# EAGLE design V1 (EAGLE 9.6.2)
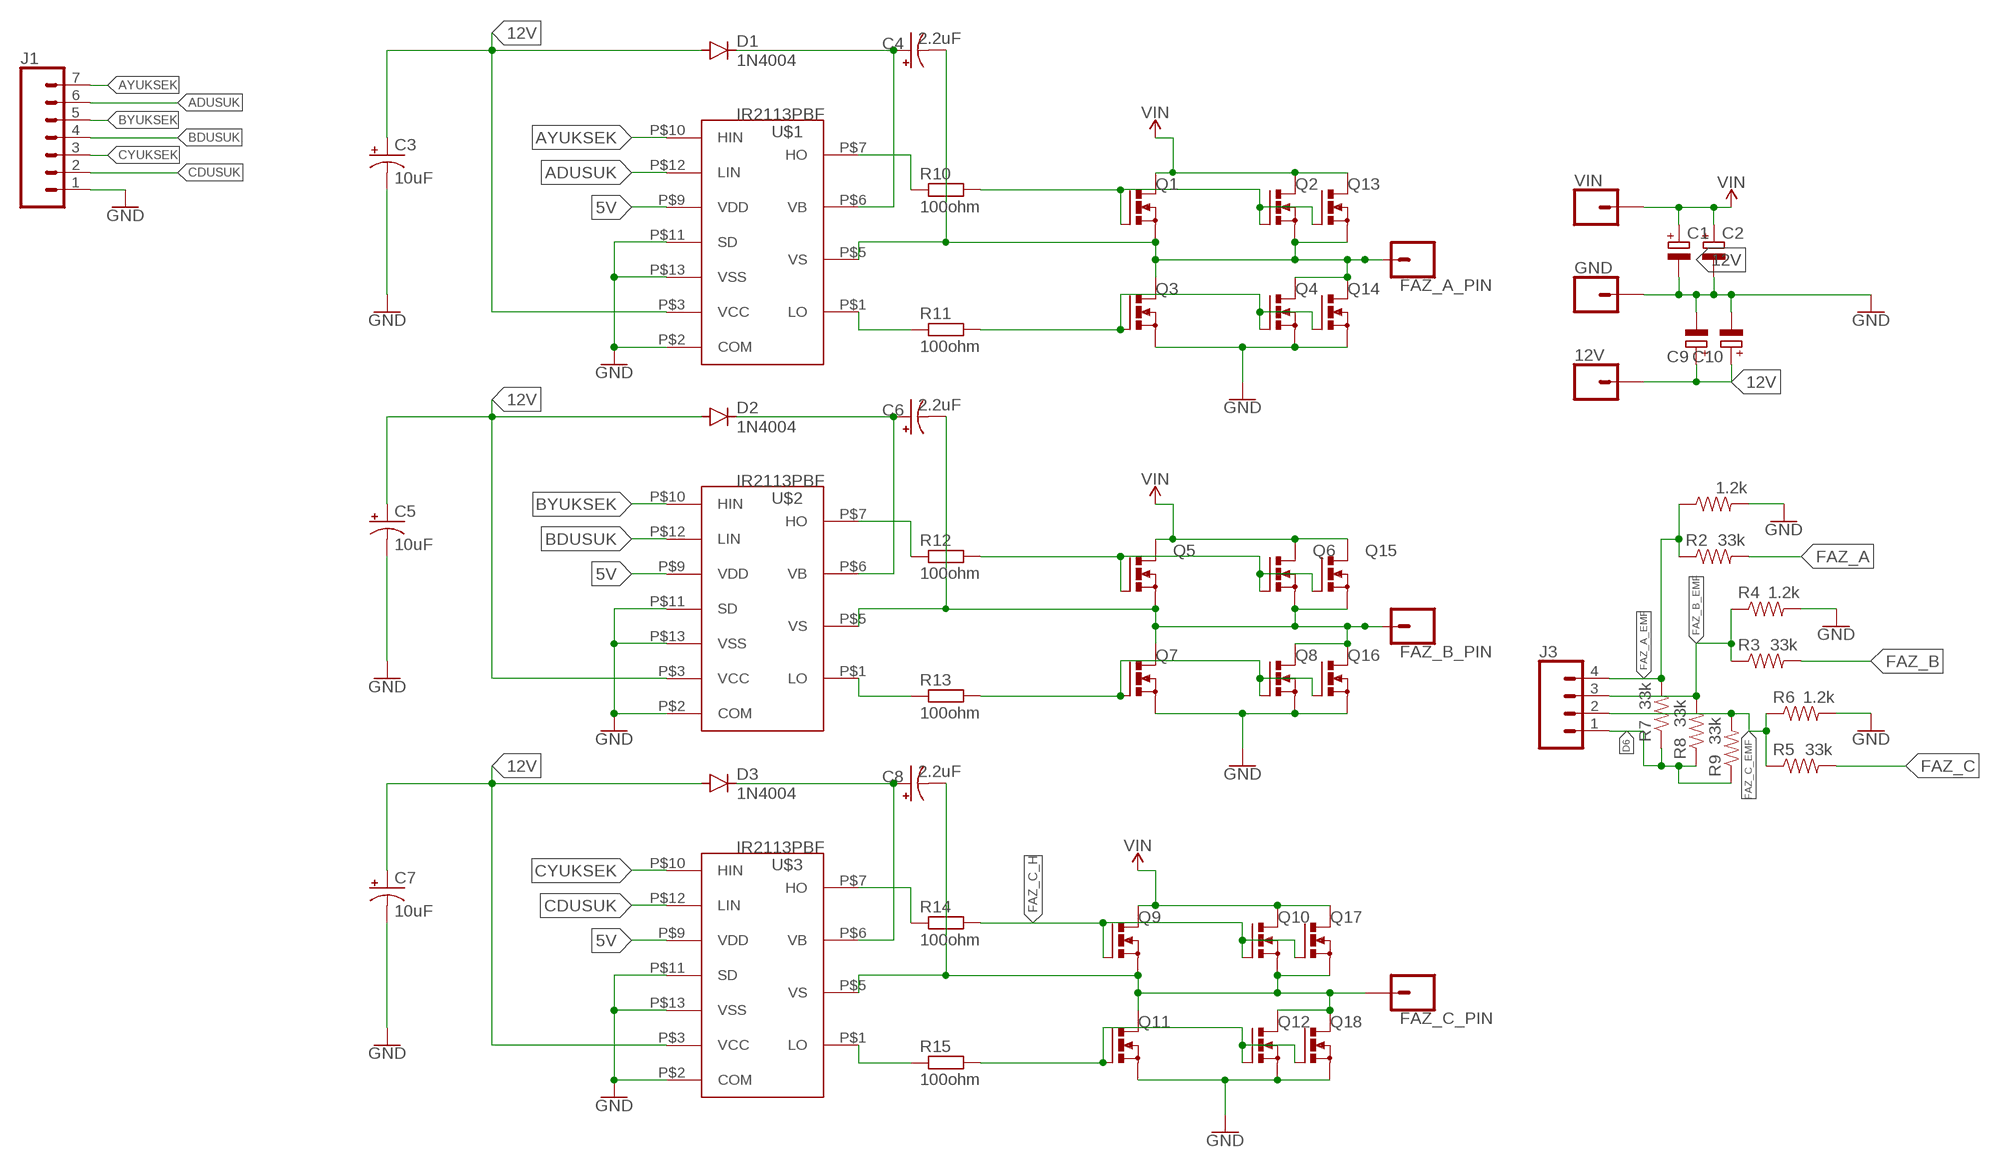
[diagram p0: schematic, sheet 1]

## Parts
12V  CONN_01SNAP-MALE  [SNAP-MALE]
C1  C-POL_RADIAL-25MM-DIA  [CAPPRD550W110D1250H2500B]
C2  C-POL_RADIAL-25MM-DIA  [CAPPRD550W110D1250H2500B]
C3  10uF  10UF-POLAR-RADIAL-2.5MM-25V-20%  [CPOL-RADIAL-2.5MM-5MM]
C4  2.2uF  10UF-POLAR-RADIAL-2.5MM-25V-20%  [CPOL-RADIAL-2.5MM-5MM]
C5  10uF  10UF-POLAR-RADIAL-2.5MM-25V-20%  [CPOL-RADIAL-2.5MM-5MM]
C6  2.2uF  10UF-POLAR-RADIAL-2.5MM-25V-20%  [CPOL-RADIAL-2.5MM-5MM]
C7  10uF  10UF-POLAR-RADIAL-2.5MM-25V-20%  [CPOL-RADIAL-2.5MM-5MM]
C8  2.2uF  10UF-POLAR-RADIAL-2.5MM-25V-20%  [CPOL-RADIAL-2.5MM-5MM]
C9  C-POL_RADIAL-25MM-DIA  [CAPPRD550W110D1250H2500B]
C10  C-POL_RADIAL-25MM-DIA  [CAPPRD550W110D1250H2500B]
D1  1N4004  [DO41-10]
D2  1N4004  [DO41-10]
D3  1N4004  [DO41-10]
FAZ_A_PIN  CONN_01SNAP-MALE  [SNAP-MALE]
FAZ_B_PIN  CONN_01SNAP-MALE  [SNAP-MALE]
FAZ_C_PIN  CONN_01SNAP-MALE  [SNAP-MALE]
GND  CONN_01SNAP-MALE  [SNAP-MALE]
J1  CONN_07  [1X07]
J3  CONN_04  [1X04]
Q1  PMOSFET_NTO220BV  [TO220BV]
Q2  PMOSFET_NTO220BV  [TO220BV]
Q3  PMOSFET_NTO220BV  [TO220BV]
Q4  PMOSFET_NTO220BV  [TO220BV]
Q5  PMOSFET_NTO220BV  [TO220BV]
Q6  PMOSFET_NTO220BV  [TO220BV]
Q7  PMOSFET_NTO220BV  [TO220BV]
Q8  PMOSFET_NTO220BV  [TO220BV]
Q9  PMOSFET_NTO220BV  [TO220BV]
Q10  PMOSFET_NTO220BV  [TO220BV]
Q11  PMOSFET_NTO220BV  [TO220BV]
Q12  PMOSFET_NTO220BV  [TO220BV]
Q13  PMOSFET_NTO220BV  [TO220BV]
Q14  PMOSFET_NTO220BV  [TO220BV]
Q15  PMOSFET_NTO220BV  [TO220BV]
Q16  PMOSFET_NTO220BV  [TO220BV]
Q17  PMOSFET_NTO220BV  [TO220BV]
Q18  PMOSFET_NTO220BV  [TO220BV]
R1  1.2k  15KOHM-HORIZ-1/4W-5%  [AXIAL-0.3]
R2  33k  15KOHM-HORIZ-1/4W-5%  [AXIAL-0.3]
R3  33k  15KOHM-HORIZ-1/4W-5%  [AXIAL-0.3]
R4  1.2k  15KOHM-HORIZ-1/4W-5%  [AXIAL-0.3]
R5  33k  15KOHM-HORIZ-1/4W-5%  [AXIAL-0.3]
R6  1.2k  15KOHM-HORIZ-1/4W-5%  [AXIAL-0.3]
R7  33k  15KOHM-HORIZ-1/4W-5%  [AXIAL-0.3]
R8  33k  15KOHM-HORIZ-1/4W-5%  [AXIAL-0.3]
R9  33k  15KOHM-HORIZ-1/4W-5%  [AXIAL-0.3]
R10  100ohm  R-EU_0207/10  [0207/10]
R11  100ohm  R-EU_0207/10  [0207/10]
R12  100ohm  R-EU_0207/10  [0207/10]
R13  100ohm  R-EU_0207/10  [0207/10]
R14  100ohm  R-EU_0207/10  [0207/10]
R15  100ohm  R-EU_0207/10  [0207/10]
U$1  IR2113PBF  [PDIP-14]
U$2  IR2113PBF  [PDIP-14]
U$3  IR2113PBF  [PDIP-14]
VIN  CONN_01SNAP-MALE  [SNAP-MALE]

## Nets
5V: U$1.P$9(VDD) U$2.P$9(VDD) U$3.P$9(VDD)
12V: 12V.2 C3.1(+) C5.1(+) C7.1(+) C9.1(+) C10.1(+) D1.A D2.A D3.A U$1.P$3(VCC) U$2.P$3(VCC) U$3.P$3(VCC)
ADUSUK: J1.6 U$1.P$12(LIN)
AYUKSEK: J1.7 U$1.P$10(HIN)
BDUSUK: J1.4 U$2.P$12(LIN)
BYUKSEK: J1.5 U$2.P$10(HIN)
CDUSUK: J1.2 U$3.P$12(LIN)
CYUKSEK: J1.3 U$3.P$10(HIN)
D6: J3.1 R7.P$1 R8.P$1 R9.P$1
FAZ_A: C4.2(-) FAZ_A_PIN.2 Q1.S Q2.S Q3.D Q4.D Q13.S Q14.D R2.P$2 U$1.P$5(VS)
FAZ_A_EMF: J3.4 R1.P$1 R2.P$1 R7.P$2
FAZ_A_H: Q1.G Q2.G Q13.G R10.2
FAZ_A_L: Q3.G Q4.G Q14.G R11.2
FAZ_B: C6.2(-) FAZ_B_PIN.2 Q5.S Q6.S Q7.D Q8.D Q15.S Q16.D R3.P$2 U$2.P$5(VS)
FAZ_B_EMF: J3.3 R3.P$1 R4.P$1 R8.P$2
FAZ_B_H: Q5.G Q6.G Q15.G R12.2
FAZ_B_L: Q7.G Q8.G Q16.G R13.2
FAZ_C: C8.2(-) FAZ_C_PIN.2 Q9.S Q10.S Q11.D Q12.D Q17.S Q18.D R5.P$2 U$3.P$5(VS)
FAZ_C_EMF: J3.2 R5.P$1 R6.P$1 R9.P$2
FAZ_C_H: Q9.G Q10.G Q17.G R14.2
FAZ_C_L: Q11.G Q12.G Q18.G R15.2
GND: C1.2(-) C2.2(-) C3.2(-) C5.2(-) C7.2(-) C9.2(-) C10.2(-) GND.2 J1.1 Q3.S Q4.S Q7.S Q8.S Q11.S Q12.S Q14.S Q16.S Q18.S R1.P$2 R4.P$2 R6.P$2 U$1.P$2(COM) U$1.P$11(SD) U$1.P$13(VSS) U$2.P$2(COM) U$2.P$11(SD) U$2.P$13(VSS) U$3.P$2(COM) U$3.P$11(SD) U$3.P$13(VSS)
N$1: C6.1(+) D2.C U$2.P$6(VB)
N$2: R13.1 U$2.P$1(LO)
N$3: R12.1 U$2.P$7(HO)
N$4: C4.1(+) D1.C U$1.P$6(VB)
N$5: C8.1(+) D3.C U$3.P$6(VB)
N$6: R10.1 U$1.P$7(HO)
N$7: R15.1 U$3.P$1(LO)
N$8: R11.1 U$1.P$1(LO)
N$9: R14.1 U$3.P$7(HO)
VIN: C1.1(+) C2.1(+) Q1.D Q2.D Q5.D Q6.D Q9.D Q10.D Q13.D Q15.D Q17.D VIN.2

## Library data of the parts
12V FAZ_A_PIN FAZ_B_PIN FAZ_C_PIN GND VIN = SparkFun-Connectors:CONN_01: Single connection point. Often used as Generic Header-pin footprint for 0.1 inch spaced/style header connections On any of the 0.1 inch spaced packages, you can populate with these: Break Away Headers - Straight <https://www.sparkfun.com/products/116> (PRT-00116) Break Away Male Headers - Right Angle <https://www.sparkfun.com/products/553> (PRT-00553) Female Headers <https://www.sparkfun.com/products/115> (PRT-00115) Break Away Headers - Machine Pin <https://www.sparkfun.com/products/117> (PRT-00117) Break Away Female Headers - Swiss Machine Pin <https://www.sparkfun.com/products/743> (PRT-00743) This device is also useful as a general connection point to wire up your design to another part of your project. Our various solder wires solder well into these plated through hole pads. Hook-Up Wire - Assortment (Stranded, 22 AWG) <https://www.sparkfun.com/products/11375> (PRT-11375) Hook-Up Wire - Assortment (Solid Core, 22 AWG) <https://www.sparkfun.com/products/11367> (PRT-11367) View the entire wire category on our website here <https://www.sparkfun.com/categories/141> Special notes: SMTSO-256-ET is a "flush mount" nut for a 4-40 screw. We mostly use this on specialty testbeds; it is a nice way to connect hardware to your PCB at an adjustable hieght. Also note, the SNAP packages are for using a snappable style connector. We sell a baggie of snaps and they are also used on two LilyPad designs: Snap Assortment - 30 pack (male and female) <https://www.sparkfun.com/products/11347> (DEV-11347) LilyPad Arduino SimpleSnap <https://www.sparkfun.com/products/10941> (DEV-10941) LilyPad SimpleSnap Protoboard <https://www.sparkfun.com/products/10940> (DEV-10940)
C1 C2 C9 C10 = Capacitor:C-POL: Capacitor Polarised - Generic; CATEGORY: Capacitor
C3 C5 C7 = SparkFun-Capacitors:10UF-POLAR: 10.0µF polarized capacitors A capacitor is a passive two-terminal electrical component used to store electrical energy temporarily in an electric field.; PROD_ID: CAP-08440
C4 C6 C8 = SparkFun-Capacitors:10UF-POLAR: 10.0µF polarized capacitors A capacitor is a passive two-terminal electrical component used to store electrical energy temporarily in an electric field.; PROD_ID: CAP-08440; VALUE: 10uF
D1-D3 = diode:1N4004: DIODE general purpose rectifier, 1 A
J1 = SparkFun-Connectors:CONN_07: Multi connection point. Often used as Generic Header-pin footprint for 0.1 inch spaced/style header connections On any of the 0.1 inch spaced packages, you can populate with these: Break Away Headers - Straight <https://www.sparkfun.com/products/116> (PRT-00116) Break Away Male Headers - Right Angle <https://www.sparkfun.com/products/553> (PRT-00553) Female Headers <https://www.sparkfun.com/products/115> (PRT-00115) Break Away Headers - Machine Pin <https://www.sparkfun.com/products/117> (PRT-00117) Break Away Female Headers - Swiss Machine Pin <https://www.sparkfun.com/products/743> (PRT-00743) For SCREWTERMINALS and SPRING TERMINALS visit here: Screw Terimnals on SparkFun.com <https://www.sparkfun.com/search/results?term=Screw+Terminals> (5mm/3.5mm/2.54mm spacing) This device is also useful as a general connection point to wire up your design to another part of your project. Our various solder wires solder well into these plated through hole pads. Hook-Up Wire - Assortment (Stranded, 22 AWG) <https://www.sparkfun.com/products/11375> (PRT-11375) Hook-Up Wire - Assortment (Solid Core, 22 AWG) <https://www.sparkfun.com/products/11367> (PRT-11367) View the entire wire category on our website here <https://www.sparkfun.com/categories/141> Special notes: Molex polarized connector foot print use with SKU : PRT-08231 with associated crimp pins and housings. 1MM SMD Version SKU: PRT-10208 NOTES ON THE VARIANTS LOCK and LOCK_LONGPADS... This footprint was designed to help hold the alignment of a through-hole component (i.e. 6-pin header) while soldering it into place. You may notice that each hole has been shifted either up or down by 0.005 of an inch from it's more standard position (which is a perfectly straight line). This slight alteration caused the pins (the squares in the middle) to touch the edges of the holes. Because they are alternating, it causes a "brace" to hold the component in place. 0.005 has proven to be the perfect amount of "off-center" position when using our standard breakaway headers. Although looks a little odd when you look at the bare footprint, once you have a header in there, the alteration is very hard to notice. Also,if you push a header all the way into place, it is covered up entirely on the bottom side.
J3 = SparkFun-Connectors:CONN_04: Multi connection point. Often used as Generic Header-pin footprint for 0.1 inch spaced/style header connections On any of the 0.1 inch spaced packages, you can populate with these: Break Away Headers - Straight <https://www.sparkfun.com/products/116> (PRT-00116) Break Away Male Headers - Right Angle <https://www.sparkfun.com/products/553> (PRT-00553) Female Headers <https://www.sparkfun.com/products/115> (PRT-00115) Break Away Headers - Machine Pin <https://www.sparkfun.com/products/117> (PRT-00117) Break Away Female Headers - Swiss Machine Pin <https://www.sparkfun.com/products/743> (PRT-00743) For SCREWTERMINALS and SPRING TERMINALS visit here: Screw Terimnals on SparkFun.com <https://www.sparkfun.com/search/results?term=Screw+Terminals> (5mm/3.5mm/2.54mm spacing) This device is also useful as a general connection point to wire up your design to another part of your project. Our various solder wires solder well into these plated through hole pads. Hook-Up Wire - Assortment (Stranded, 22 AWG) <https://www.sparkfun.com/products/11375> (PRT-11375) Hook-Up Wire - Assortment (Solid Core, 22 AWG) <https://www.sparkfun.com/products/11367> (PRT-11367) View the entire wire category on our website here <https://www.sparkfun.com/categories/141> Special notes: Molex polarized connector foot print use with SKU : PRT-08231 with associated crimp pins and housings. 1MM SMD Version SKU: PRT-10208; PROD_ID: CONN-09696
Q1-Q18 = transistor-power:PMOSFET_N: Power MOSFET N-Channel
R1-R9 = SparkFun-Resistors:15KOHM: 15kΩ resistor A resistor is a passive two-terminal electrical component that implements electrical resistance as a circuit element. Resistors act to reduce current flow, and, at the same time, act to lower voltage levels within circuits. - Wikipedia; PROD_ID: RES-11360; VALUE: 15k
R10-R15 = resistor:R-EU_: RESISTOR, European symbol
U$1-U$3 = El_yapimi:IR2113PBF

## Board
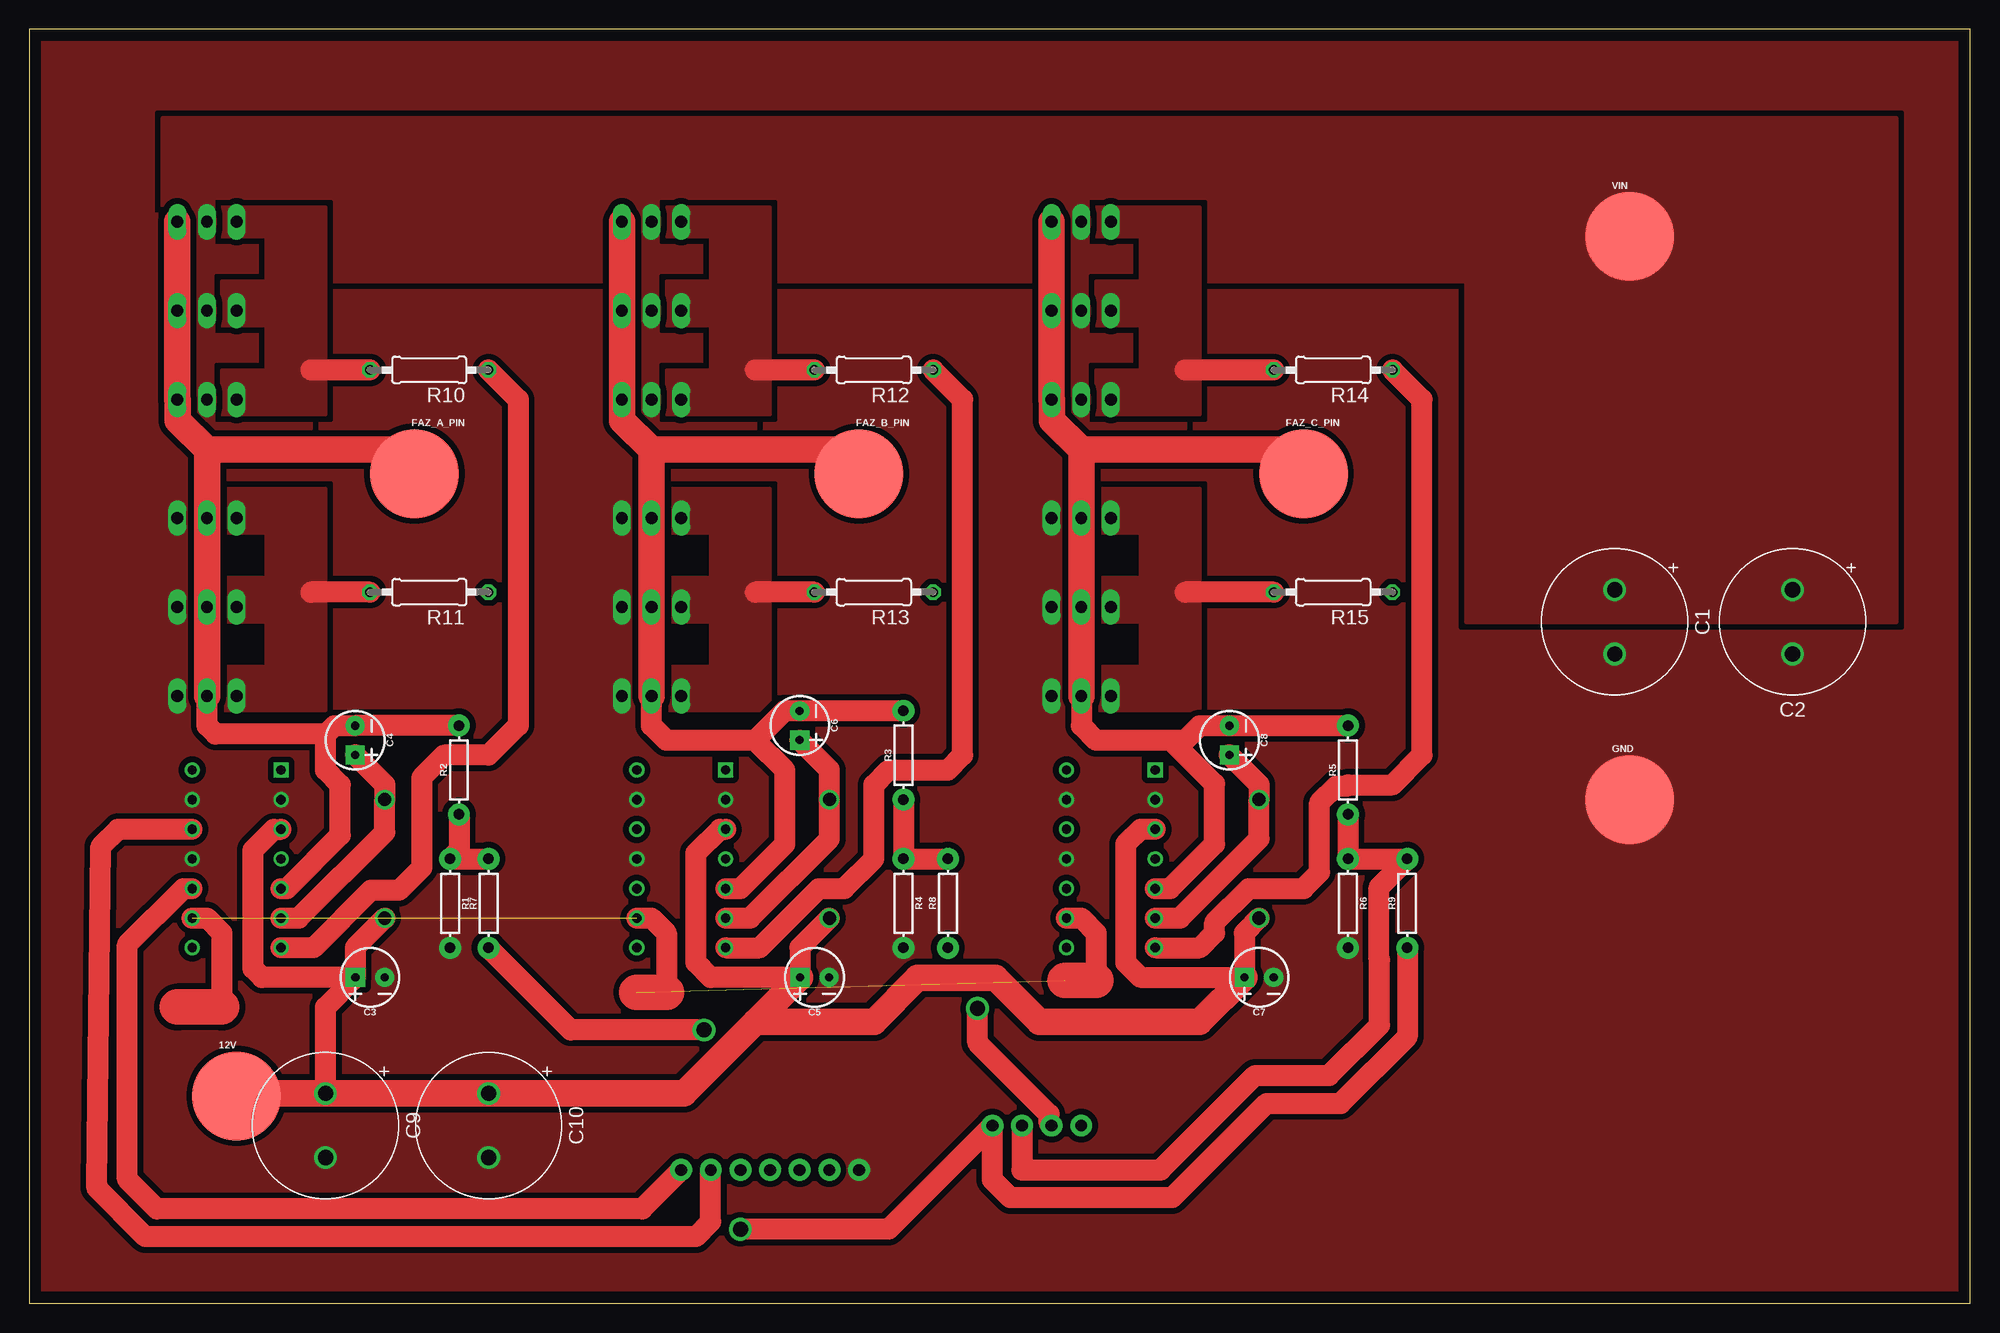
[diagram p1: board, top side]
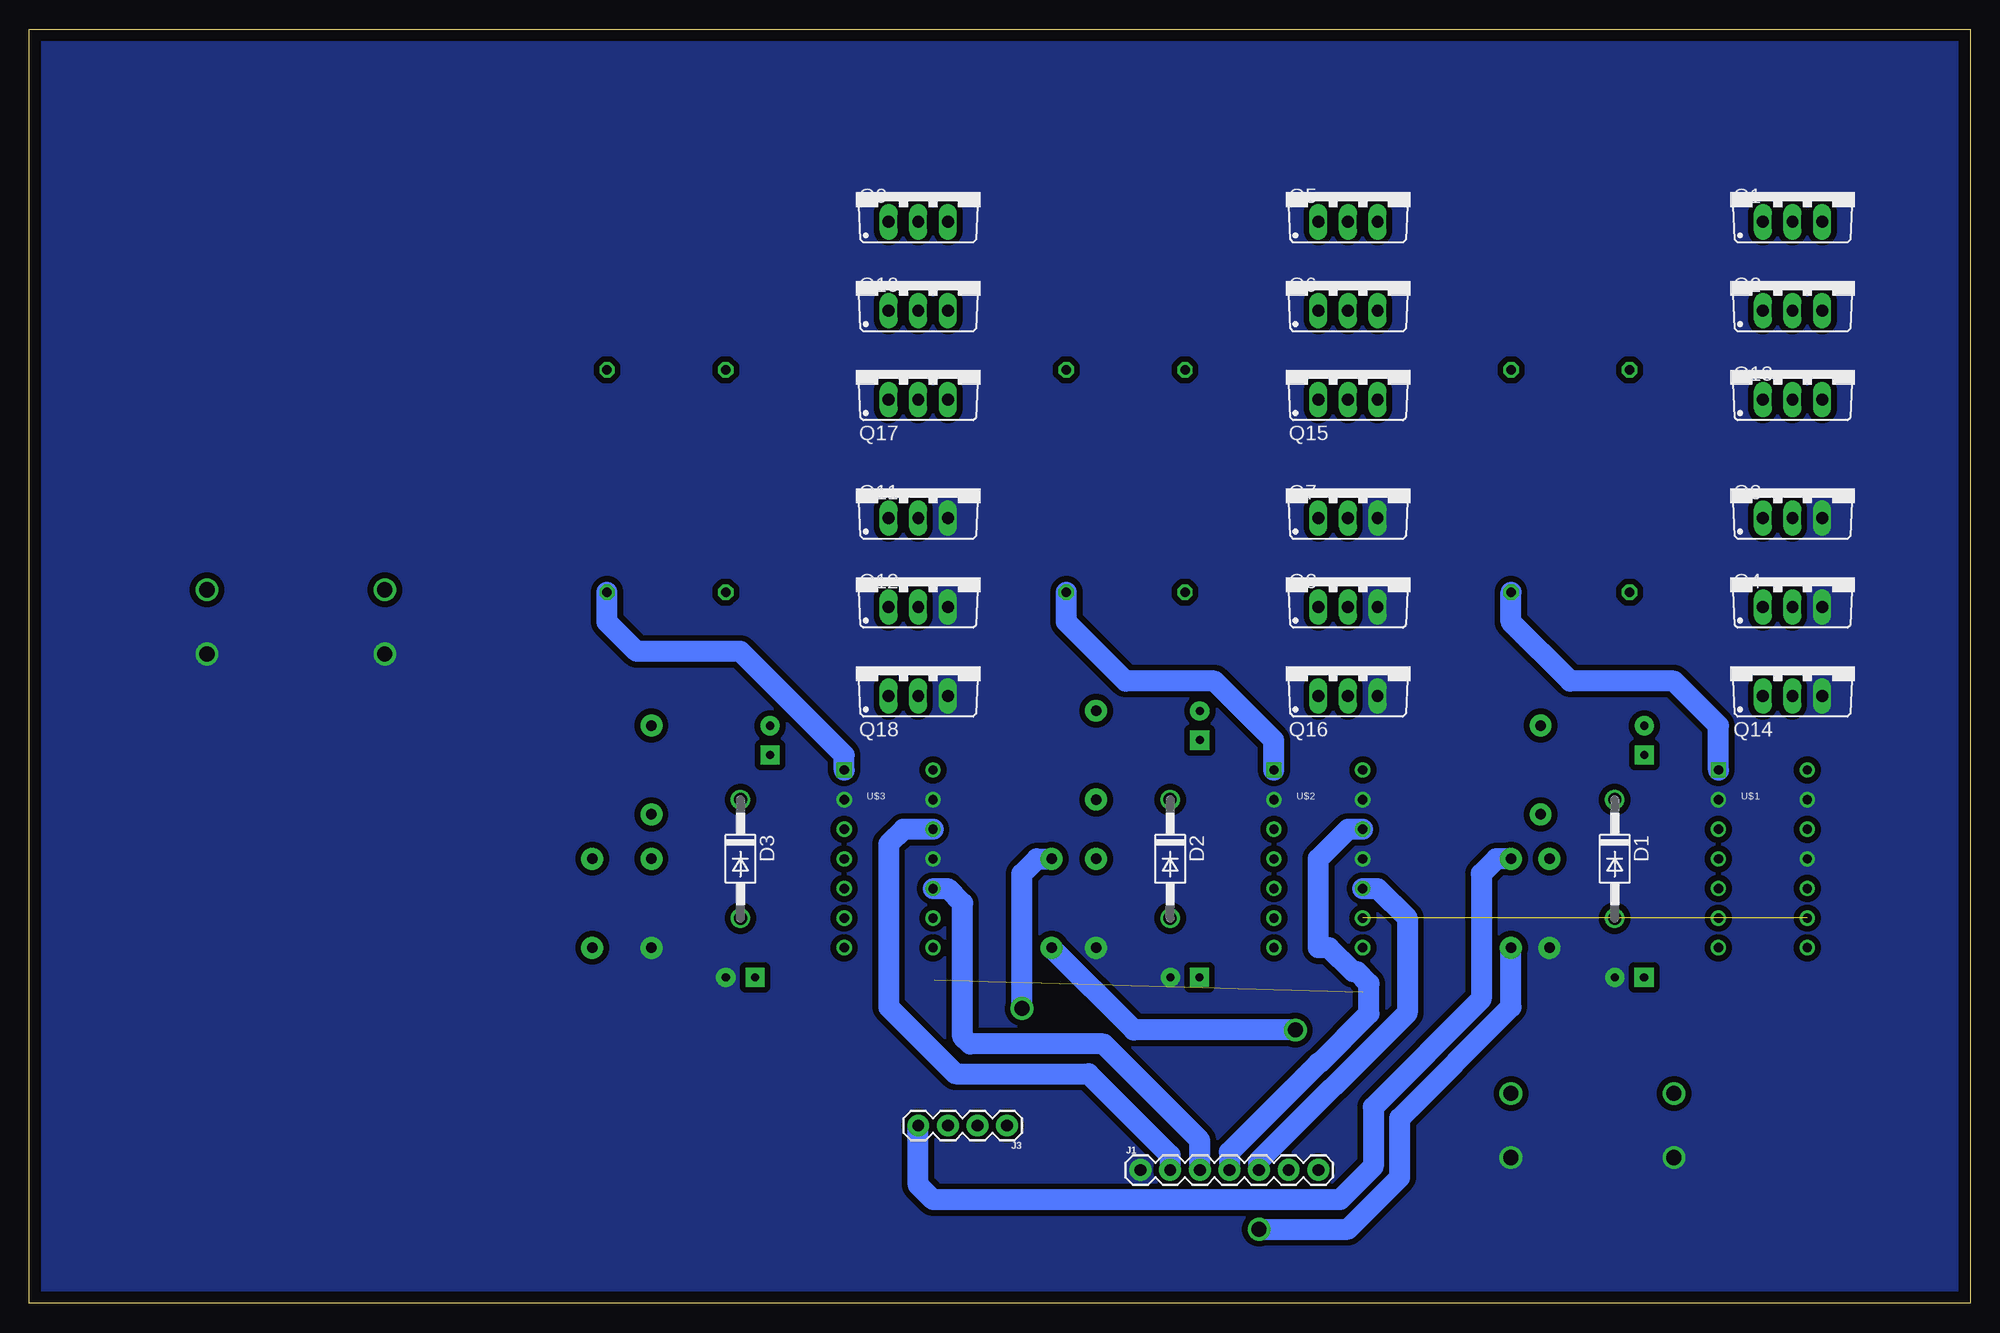
[diagram p2: board, bottom side, seen from below]

Size 166.37 x 109.22 mm. Coordinates in mm from the lower left corner, seen from the top.
Outline: 0,0 166.37,0 166.37,109.22 0,109.22 0,0
Copper layers (1*16): Top 0.035mm / dielectric 1.5mm / Bottom 0.035mm
Design rules "cnc_0.4_eagle_ayarlar *": minimum track width 6mil, minimum drill 0.35mm, track to track 0.5mm, track to pad 0.5mm, pad to pad 0.5mm, via to via 0.5mm, smd to smd 0.5mm, copper to edge 40mil, drill to drill 6mil, minimum pad ring 10mil, minimum via ring 8mil, stop-mask expansion 4mil, vias tented up to drill 0mil, thermal gap 0.5mm

### Footprints (pad centres in the part's own frame; a part is rotated, then mirrored left to right if it is on the bottom)
SNAP-MALE = smd 7.62 x 7.62: 2 0,0
CAPPRD550W110D1250H2500B = drill 1.3 pad 1.95: 1 -2.75,0; 2 2.75,0
CPOL-RADIAL-2.5MM-5MM = drill 0.7 pad 1.651 square: 1 1.25,0 | drill 0.7 pad 1.651: 2 -1.25,0
DO41-10 = drill 1.118: A 5.08,0; C -5.08,0
1X07 = drill 1.016 pad 1.88: 1 0,0; 2 2.54,0; 3 5.08,0; 4 7.62,0; 5 10.16,0; 6 12.7,0; 7 15.24,0
1X04 = drill 1.016 pad 1.88: 1 0,0; 2 2.54,0; 3 5.08,0; 4 7.62,0
TO220BV = drill 1.016 long: D 0,-2.54; G -2.54,-2.54; S 2.54,-2.54
AXIAL-0.3 = drill 0.9 pad 1.88: P$1 -3.81,0; P$2 3.81,0
0207/10 = drill 0.813 octagon: 1 -5.08,0; 2 5.08,0
PDIP-14 = drill 0.8 square: P$1 -3.81,7.62 | drill 0.8: P$2 -3.81,5.08; P$3 -3.81,2.54; P$4 -3.81,0; P$5 -3.81,-2.54; P$6 -3.81,-5.08; P$7 -3.81,-7.62; P$8 3.81,-7.62; P$9 3.81,-5.08; P$10 3.81,-2.54; P$11 3.81,0; P$12 3.81,2.54; P$13 3.81,5.08; P$14 3.81,7.62

### Placement (x,y rotation side)
12V  17.78,17.78 0 top
C1  135.89,58.42 270 top
C2  151.13,58.42 270 top
C3  29.21,27.94 180 top
C4  27.94,48.26 270 top
C5  67.31,27.94 180 top
C6  66.04,49.53 270 top
C7  105.41,27.94 180 top
C8  102.87,48.26 270 top
C9  25.4,15.24 270 top
C10  39.37,15.24 270 top
D1  30.48,38.1 270 bottom
D2  68.58,38.1 270 bottom
D3  105.41,38.1 270 bottom
FAZ_A_PIN  33.02,71.12 0 top
FAZ_B_PIN  71.12,71.12 0 top
FAZ_C_PIN  109.22,71.12 0 top
GND  137.16,43.18 0 top
J1  71.12,11.43 0 bottom
J3  82.55,15.24 180 bottom
Q1  15.24,95.25 0 bottom
Q2  15.24,87.63 0 bottom
Q3  15.24,69.85 0 bottom
Q4  15.24,62.23 0 bottom
Q5  53.34,95.25 0 bottom
Q6  53.34,87.63 0 bottom
Q7  53.34,69.85 0 bottom
Q8  53.34,62.23 0 bottom
Q9  90.17,95.25 0 bottom
Q10  90.17,87.63 0 bottom
Q11  90.17,69.85 0 bottom
Q12  90.17,62.23 0 bottom
Q13  15.24,80.01 0 bottom
Q14  15.24,54.61 0 bottom
Q15  53.34,80.01 0 bottom
Q16  53.34,54.61 0 bottom
Q17  90.17,80.01 0 bottom
Q18  90.17,54.61 0 bottom
R1  36.07,34.29 270 top
R2  36.83,45.72 90 top
R3  74.93,46.99 90 top
R4  74.93,34.29 270 top
R5  113.03,45.72 90 top
R6  113.03,34.29 270 top
R7  39.37,34.29 90 top
R8  78.74,34.29 90 top
R9  118.11,34.29 90 top
R10  34.29,80.01 180 top
R11  34.29,60.96 180 top
R12  72.39,80.01 180 top
R13  72.39,60.96 180 top
R14  111.76,80.01 180 top
R15  111.76,60.96 180 top
U$1  17.78,38.1 0 bottom
U$2  55.88,38.1 0 bottom
U$3  92.71,38.1 0 bottom
VIN  137.16,91.44 0 top

### Tracks (layer width: path | path; a pad name or v marks a point on that pad's centre or on a via)
5V  (2 unrouted)
  Top 1.778: U$1.P$9 15.24,33.02 16.51,31.75 16.51,25.4 | U$2.P$9 53.34,33.02 54.61,31.75 54.61,26.67 | U$3.P$9 90.17,33.02 91.44,31.75 91.44,27.69
  Top 3.048: 16.51,25.4 12.7,25.4 | 54.61,26.67 52.07,26.67 | 91.44,27.69 88.77,27.69
12V
  Top 1.778: D1.A 27.96,30.5 C3.1 | C3.1 19.96,27.94 19.19,28.7 19.19,38.86 20.96,40.62 21.57,40.62 U$1.P$3 | D2.A 66.06,30.5 C5.1 58.42,27.94 57.15,29.21 57.15,38.59 59.2,40.64 U$2.P$3 | D3.A 104.14,31.75 104.14,27.96 | 104.14,27.96 C7.1 | U$3.P$3 95.25,40.64 93.98,39.37 93.98,29.21 95.23,27.96 104.14,27.96 | C9.1 25.4,25.38 C3.1 | 12V.2 17.99,17.99
  Top 2.286: 17.99,17.99 C9.1 C10.1 56.11,17.99 62.25,24.13 | 62.25,24.13 C5.1 | 104.14,27.96 100.31,24.13 86.58,24.13 82.81,27.9 76.16,27.9 72.39,24.13 62.25,24.13
ADUSUK
  Top 1.778: U$1.P$12 7.62,40.64 6.14,39.16 5.79,10.17 5.79,9.89 9.96,5.72 10.16,5.72 | 10.16,5.72 57.14,5.72 58.42,7 J1.6 | 10.16,5.72
AYUKSEK
  Top 1.778: J1.7 52.55,8.1 10.95,8.1 8.41,10.63 8.41,30.75 13.22,35.56 U$1.P$10
BDUSUK
  Bottom 1.778: U$2.P$12 53.34,40.64 55.88,38.1 55.88,30.48 54.96,30.48 52.92,28.44 52.57,28.44 51.52,27.39 51.52,24.86 55.8,20.57 55.88,20.57 63.5,12.95 J1.4
BYUKSEK
  Bottom 1.778: U$2.P$10 50.8,35.56 48.26,33.02 48.26,24.9 60.96,12.2 J1.5
CDUSUK
  Bottom 1.778: U$3.P$12 91.44,40.64 92.71,39.37 92.71,25.4 87,19.68 75.56,19.68 68.58,12.7 J1.2
CYUKSEK
  Bottom 1.778: J1.3 66.04,13.97 74.3,22.23 85.72,22.23 86.36,22.86 86.36,34.29 87.63,35.56 U$3.P$10
D6  (via drill 1.3)
  Top 1.778: R9.P$1 118.11,22.86 112.39,17.14 106.05,17.14 97.95,9.05 84.11,9.05 82.55,10.61 J3.1 73.66,6.35 v60.96,6.35 | v57.85,23.43 46.42,23.43 R7.P$1
  Bottom 1.778: v57.85,23.43 71.69,23.43 R8.P$1 | R7.P$1 39.37,25.4 48.9,15.88 48.9,10.79 53.34,6.35 v60.96,6.35
FAZ_A
  Top 1.778: 25.43,48.8 15.97,48.8 15.24,49.53 Q14.D | 25.43,48.8 26.14,49.51 C4.2 27.96,49.53 R2.P$2 | U$1.P$5 22.1,35.56 26.67,40.13 26.67,44.45 25.4,45.72 25.4,48.77 25.43,48.8
  Top 2.286: Q14.D Q4.D Q3.D 15.24,73.17 | Q1.S Q2.S Q13.S 12.73,77.44 12.73,75.67 15.24,73.17 | 15.24,73.17 30.98,73.17 FAZ_A_PIN.2
FAZ_A_EMF
  Top 1.778: R2.P$1 36.83,38.86 R1.P$1 R7.P$2
  Bottom 1.778: R7.P$2 40.64,38.1 41.91,36.83 41.91,26.08 51.17,16.82 51.17,11.74 54.02,8.89 88.9,8.89 90.17,10.16 J3.4
FAZ_A_H
  Top 1.778: R10.2 24.13,80.01
  pour Top (no thermals): 25.4,93.98 16.51,93.98 16.51,91.44 20.32,91.44 20.32,87.63 16.51,87.63 16.51,83.82 20.32,83.82 20.32,80.01 16.51,80.01 16.51,76.2 25.4,76.2
FAZ_A_L
  Top 1.778: R11.2 24.13,60.96
  pour Top (no thermals): 25.4,69.85 16.51,69.85 16.51,66.04 20.32,66.04 20.32,62.23 16.51,62.23 16.51,58.42 20.32,58.42 20.32,54.61 16.51,54.61 16.51,50.8 25.4,50.8
FAZ_B
  Top 1.778: U$2.P$5 60.96,35.56 64.77,39.37 64.77,45.72 62.23,48.26 | 62.23,48.26 54.61,48.26 53.34,49.53 Q16.D | 62.23,48.26 64.75,50.78 C6.2 66.06,50.8 R3.P$2
  Top 2.286: Q16.D Q8.D Q7.D 53.34,73.17 | Q5.S Q6.S Q15.S 50.84,77.44 50.84,75.67 53.34,73.17 | 53.34,73.17 69.08,73.17 FAZ_B_PIN.2
FAZ_B_EMF  (via drill 1.3)
  Top 1.778: R3.P$1 R4.P$1 R8.P$2 | J3.3 87.42,15.45 87.42,16.2 81.28,22.34 v81.28,25.28
  Bottom 1.778: v81.28,25.28 81.28,36.83 80.01,38.1 R8.P$2
FAZ_B_H
  Top 1.778: R12.2 62.23,80.01
  pour Top (no thermals): 63.5,93.98 54.61,93.98 54.61,91.44 58.42,91.44 58.42,87.63 54.61,87.63 54.61,83.82 58.42,83.82 58.42,80.01 54.61,80.01 54.61,76.2 63.5,76.2
FAZ_B_L
  Top 1.778: R13.2 62.23,60.96
  pour Top (no thermals): 63.5,69.85 54.61,69.85 54.61,66.04 58.42,66.04 58.42,62.23 54.61,62.23 54.61,58.42 58.42,58.42 58.42,54.61 54.61,54.61 54.61,50.8 63.5,50.8
FAZ_C
  Top 1.778: R5.P$2 102.89,49.53 C8.2 100.31,49.51 99.06,48.26 97.86,48.26 | Q18.D 90.17,49.53 91.44,48.26 97.86,48.26 | U$3.P$5 97.79,35.56 101.6,39.37 101.6,44.52 97.86,48.26
  Top 2.286: Q9.S Q10.S Q17.S 87.67,77.44 87.67,75.67 90.17,73.17 | 90.17,73.17 Q11.D Q12.D Q18.D | 90.17,73.17 107.17,73.17 FAZ_C_PIN.2
FAZ_C_EMF
  Top 1.778: R5.P$1 R6.P$1 R9.P$2 115.68,35.67 115.68,29.47 115.73,29.42 115.73,23.84 111.41,19.52 105.06,19.52 96.97,11.43 85.09,11.43 J3.2
FAZ_C_H
  Top 1.778: R14.2 99.06,80.01
  pour Top (no thermals): 100.33,93.98 91.44,93.98 91.44,91.44 95.25,91.44 95.25,87.63 91.44,87.63 91.44,83.82 95.25,83.82 95.25,80.01 91.44,80.01 91.44,76.2 100.33,76.2
FAZ_C_L
  Top 1.778: R15.2 99.06,60.96
  pour Top (no thermals): 100.33,69.85 91.44,69.85 91.44,66.04 95.25,66.04 95.25,62.23 91.44,62.23 91.44,58.42 95.25,58.42 95.25,54.61 91.44,54.61 91.44,50.8 100.33,50.8
GND
  pour Top (rank 6, no thermals): -2.54,111.76 -2.54,-2.54 168.91,-2.54 168.91,111.76
  pour Bottom (rank 6, no thermals): -1.27,110.49 -1.27,-1.27 167.64,-1.27 167.64,110.49
N$1
  Top 1.778: U$2.P$6 61.79,33.02 68.58,39.81 D2.C 68.58,45.74 C6.1
N$2
  Bottom 1.778: U$2.P$1 59.69,48.26 64.77,53.34 72.39,53.34 77.47,58.42 R13.1
N$3
  Top 1.778: U$2.P$7 62.61,30.48 67.69,35.56 69.85,35.56 72.39,38.1 72.39,44.45 73.66,45.72 78.74,45.72 80.01,46.99 80.01,77.47 R12.1
N$4
  Top 1.778: C4.1 30.48,44.47 D1.C 30.48,40.39 23.11,33.02 U$1.P$6
N$5
  Top 1.778: C8.1 105.41,44.47 D3.C 105.41,39.81 98.63,33.04 96.54,33.04 U$3.P$6
N$6
  Top 1.778: R10.1 41.91,77.47 41.91,49.53 39.37,46.99 35.56,46.99 33.64,45.07 33.64,37.34 31.7,35.4 29.29,35.4 24.37,30.48 U$1.P$7
N$7
  Bottom 1.778: U$3.P$1 96.52,46.99 105.41,55.88 114.3,55.88 116.84,58.42 R15.1
N$8
  Bottom 1.778: U$1.P$1 21.59,49.53 25.4,53.34 34.29,53.34 39.37,58.42 R11.1
N$9
  Top 1.778: U$3.P$7 100.33,30.48 101.6,31.75 101.6,32.64 104.52,35.56 109.22,35.56 110.6,36.94 110.6,42.92 112.02,44.34 112.92,44.34 113.03,44.45 116.84,44.45 119.38,46.99 119.38,77.47 R14.1
VIN
  pour Top (rank 2, no thermals): 11.43,101.6 11.43,74.93 24.13,74.93 24.13,87.63 52.07,87.63 52.07,74.93 62.23,74.93 62.23,87.63 88.9,87.63 88.9,74.93 99.06,74.93 99.06,87.63 123.19,87.63 123.19,58.42 160.02,58.42 160.02,101.6